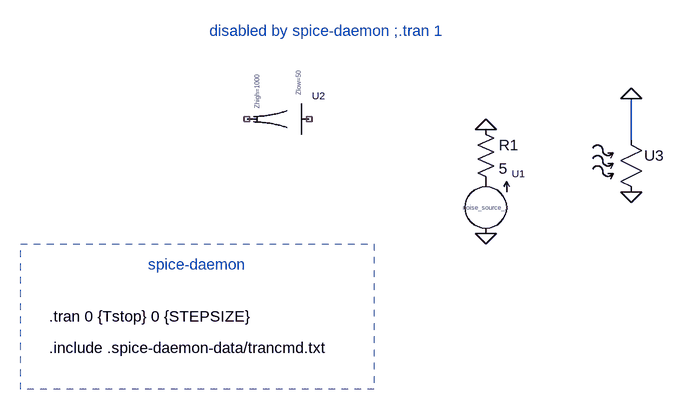
[diagram p0: schematic init2.asc]
init2.asc, the LTspice schematic file:
Version 4
SHEET 1 1364 740
WIRE 1136 352 1136 288
FLAG 912 496 0
FLAG 912 336 0
FLAG 1136 432 0
FLAG 1136 288 0
SYMBOL noise_source_1 912 416 R0
SYMATTR InstName U1
SYMBOL Res 896 320 R0
SYMATTR InstName R1
SYMATTR Value 5
SYMBOL taper_1 592 320 R0
SYMATTR InstName U2
SYMBOL johnson_res_1 1120 336 R0
SYMATTR InstName U3
TEXT 480 184 Left 2 ; disabled by spice-daemon ;.tran 1
TEXT 240 672 Left 2 !.include .spice-daemon-data/trancmd.txt
TEXT 392 544 Left 2 ;spice-daemon
TEXT 240 624 Left 2 !.tran 0 {Tstop} 0 {STEPSIZE}
RECTANGLE Normal 740 736 196 512 2

The netlist it stands for:
* init2.asc
XU1 P001 0 noise_source_1  ; pins in out
R1 0 P001 5
XU2 NC_01 NC_02 taper_1  ; pins in out
XU3 0 0 johnson_res_1  ; pins A B
*  disabled by spice-daemon ;.tran 1
.include .spice-daemon-data/trancmd.txt
* spice-daemon
.tran 0 {Tstop} 0 {STEPSIZE}
.lib /Users/torque/programs/spice-daemon/test/.spice-daemon-data/spice-daemon.lib
.backanno
.end